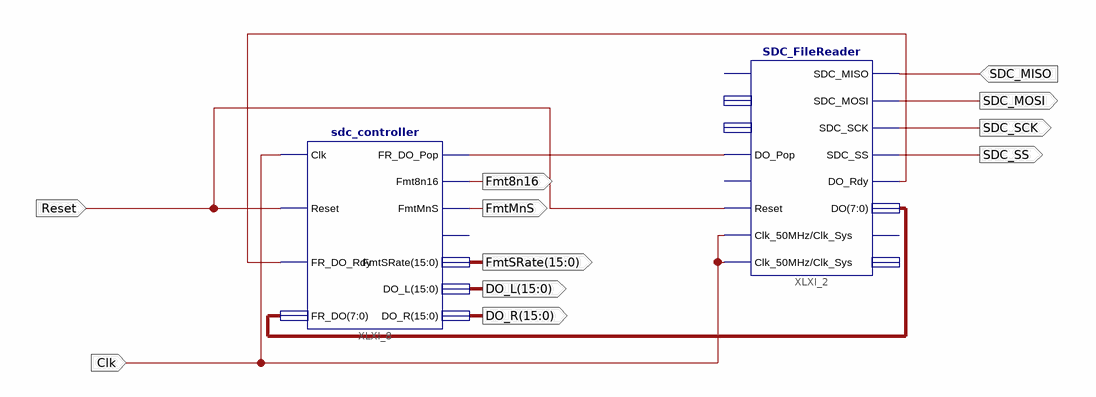
[diagram p0: schematic sheet 1]
// Xilinx ISE schematic schemat.sch (artix7) as structural Verilog: 2 symbols, 11 ports
module schemat (
  input  SDC_MISO,
  input  Clk,
  input  Reset,
  output SDC_MOSI,
  output SDC_SCK,
  output SDC_SS,
  output Fmt8n16,
  output FmtMnS,
  output [15:0] FmtSRate,
  output [15:0] DO_L,
  output [15:0] DO_R
);

  wire XLXN_5, XLXN_8;
  wire [7:0] XLXN_9;

  SDC_FileReader XLXI_2 (
    .SDC_MISO(SDC_MISO), .Reset(Reset), .Clk_50MHz(Clk), .DO_Pop(XLXN_5), .SDC_MOSI(SDC_MOSI),
    .SDC_SCK(SDC_SCK), .SDC_SS(SDC_SS), .DO(XLXN_9), .DO_Rdy(XLXN_8), .Clk_Sys(Clk));  // open: Start, FName, Abort, Error, Busy, FExt
  sdc_controller XLXI_8 (
    .Clk(Clk), .Reset(Reset), .FR_DO_Rdy(XLXN_8), .FR_DO(XLXN_9), .FR_DO_Pop(XLXN_5), .Fmt8n16(Fmt8n16),
    .FmtMnS(FmtMnS), .FmtSRate(FmtSRate), .DO_L(DO_L), .DO_R(DO_R));  // open: STickRate
endmodule
